# Altium schematic sheet water_level_v3.SchDoc
size A4; DocumentNumber: 1; SheetNumber: 1; SheetTotal: 2
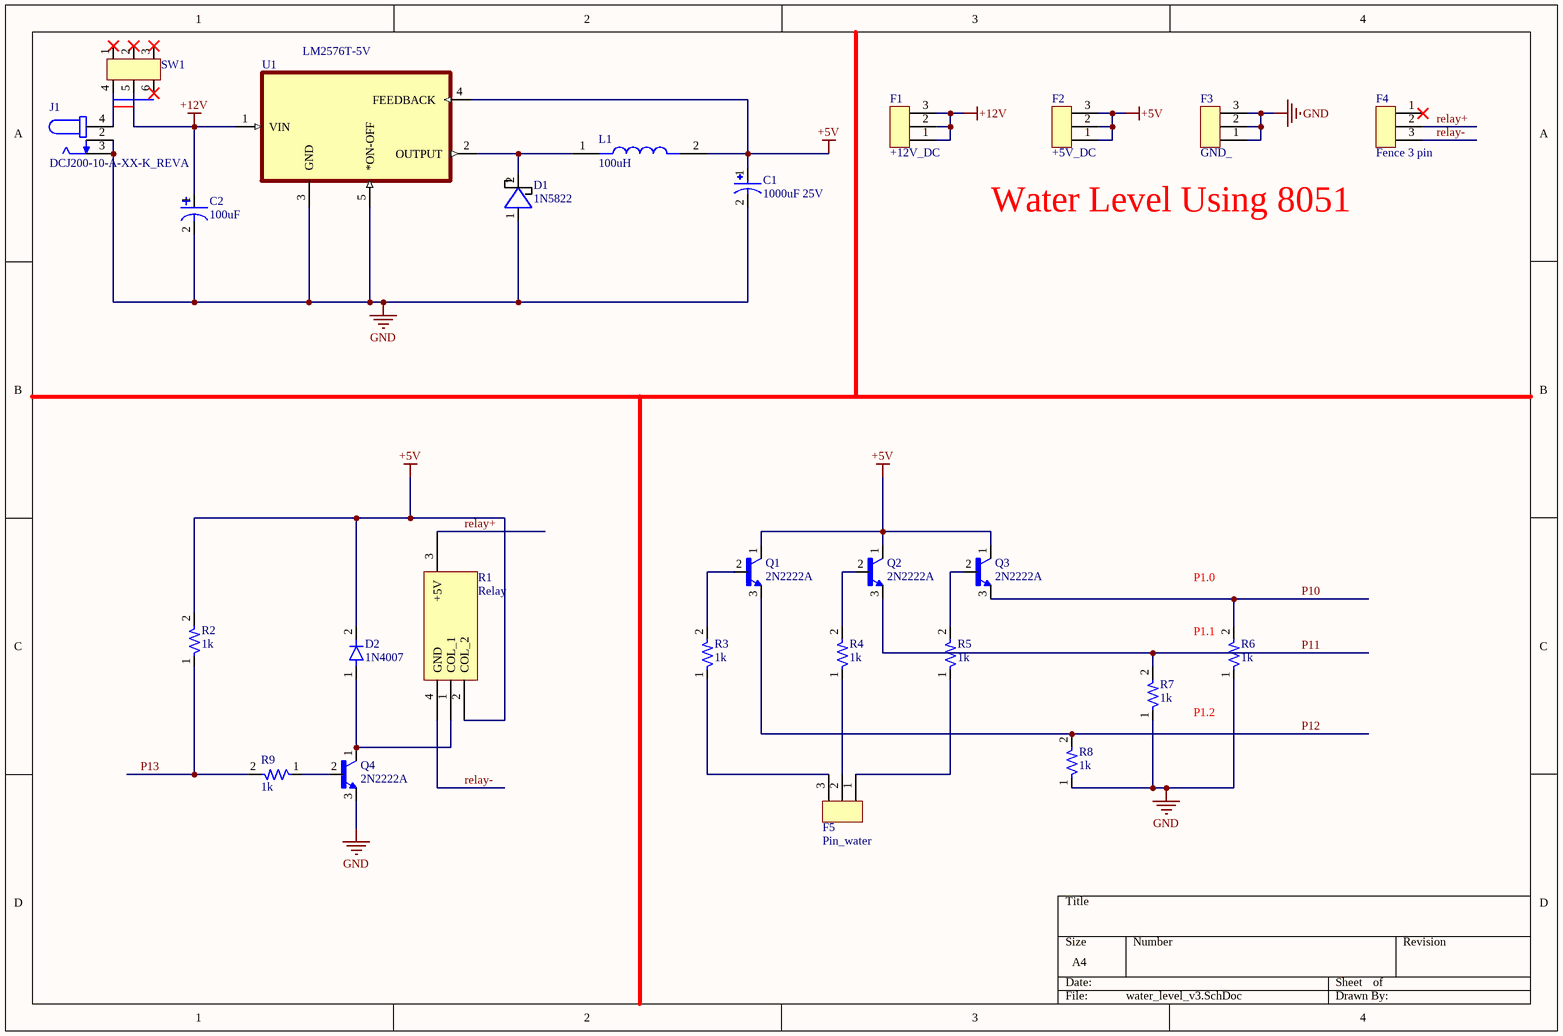
[diagram p0: water_level_v3.SchDoc]

## Parts
C1  1000uF 25V  [Capacitor 1000uF 25V]
C2  100uF  [Capacitor 100uF 35V]
D1  1N5822  [Diode 1N5822]
D2  1N4007  [1N4007]
F1  +12V_DC  [Fence 3pin]
F2  +5V_DC  [Fence 3pin]
F3  GND_  [Fence 3pin]
F4  Fence 3 pin  [Fence 3pin]
F5  Pin_water  [Fence 3pin]
J1  DCJ200-10-A-XX-K_REVA  [GCT_DCJ200-10-A-XX-K_REVA]
L1  100uH  [Inductor]
Q1  2N2222A  [2N2222]
Q2  2N2222A  [2N2222]
Q3  2N2222A  [2N2222]
Q4  2N2222A  [2N2222]
R1  Relay  [Relay]
R2  1k  [RESISTOR 1W]
R3  1k  [RESISTOR 1W]
R4  1k  [RESISTOR 1W]
R5  1k  [RESISTOR 1W]
R6  1k  [RESISTOR 1W]
R7  1k  [RESISTOR 1W]
R8  1k  [RESISTOR 1W]
R9  1k  [RESISTOR 1W]
SW1  Push_sw 8x8mm 6pin  [PUSH_SW 6PIN]  (value not drawn)
U1  LM2576T-5V  [LM2596T-5V]

## Nets
+5V: C1.1 D2.2 F2.1 F2.2 F2.3 L1.2 Q1.1(C) Q2.1(C) Q3.1(C) R1.2(COL_2) R2.2 U1.4(FEEDBACK)
+12V: C2.1 F1.1 F1.2 F1.3 SW1.5 U1.1(VIN)
GND: C1.2 C2.2 D1.1 F3.1 F3.2 F3.3 J1.2 J1.3 Q4.3(E) R6.1 R7.1 R8.1 U1.3(GND) U1.5(*ON-OFF)
P10: Q3.3(E) R6.2
P11: Q2.3(E) R7.2
P12: Q1.3(E) R8.2
P13: R2.1 R9.2
relay+: F4.2 R1.3(+5V)
relay-: F4.3 R1.4(GND)
NetD1_2: D1.2 L1.1 U1.2(OUTPUT)
NetD2_1: D2.1 Q4.1(C) R1.1(COL_1)
NetF5_1: F5.1 R5.1
NetF5_2: F5.2 R4.1
NetF5_3: F5.3 R3.1
NetJ1_4: J1.4 SW1.4
NetQ1_2: Q1.2(B) R3.2
NetQ2_2: Q2.2(B) R4.2
NetQ3_2: Q3.2(B) R5.2
NetQ4_2: Q4.2(B) R9.1

Not connected (* = marked no-connect by the designer): F4 1*; SW1 1* 2* 3* 6*

## Notes on the sheet
- Water Level Using 8051
- P1.0
- (near R6) P1.1
- P1.2

## Library data of the parts
C1 = Capacitor 1000uF 25V: Tụ hóa 1000uF 25V / Kích thước 10x17mm; MF: {'manufacturer': u'Panasonic'}; MP: EEUTA1V101; Package: None; Price: None; Value: *; Availability: Unavailable
C2 = Capacitor 100uF: Tụ hóa 100uF 35V
D1 = Diode 1N5822: 1N5822 Diode Schottky 40V 3A DO-201AD / (Through hole)
D2 = 1N4007: Diode 1N4007 1A 1000V DIP
F1-F5 = Fence 3 pin: hàng rào male 6 chân
J1 = DCJ200-10-A-XX-K_REVA: Power Barrel Connector Jack 2.05mm ID (0.081), 5.50mm OD (0.217) Through Hole, Right Angle; MF: Global Connector Technology; MP: DCJ200-10-A-K1-K; SnapEDA_Link: https://www.snapeda.com/parts/DCJ200-10-A-K1-K/Global+Connector+Technology/view-part/?ref=snap; Package: None; Value: *; Check_prices: https://www.snapeda.com/parts/DCJ200-10-A-K1-K/Global+Connector+Technology/view-part/?ref=eda
L1 = Inductor: Cuộn cảm 100uH 0810 8x15mm
Q1-Q4 = 2N2222A: MF: {'manufacturer': u'Diotec Semiconductor'}; Package: None; Price: None; Value: *; MP: 2N2222A; Availability: Unavailable
R1 = Relay: Relay 5V5A HF46F-G 5-HS1 của Hongfa. / Vẽ dựa trên HF46F/005-HS1F(610) của Hongfa
R2-R9 = Resistor: dien tro
SW1 = Push_sw 8x8mm 6pin: 6pin free 1-3.4-6 push 2-3,4-5
U1 = LM2596T-5V: IC, STEP-DOWN VOLTAGE REGULATOR; MF: {'manufacturer': u'Texas Instruments'}; MP: LM2596T-12; Package: None; Price: None; Value: *; Availability: Unavailable